# Altium schematic sheet LED_Circuit.SchDoc
size A; SheetNumber: 1; SheetTotal: 1; SPICEModelCacheNXRCWZZP: <root> / <DocumentId>NXRCWZZP</DocumentId> / </root>
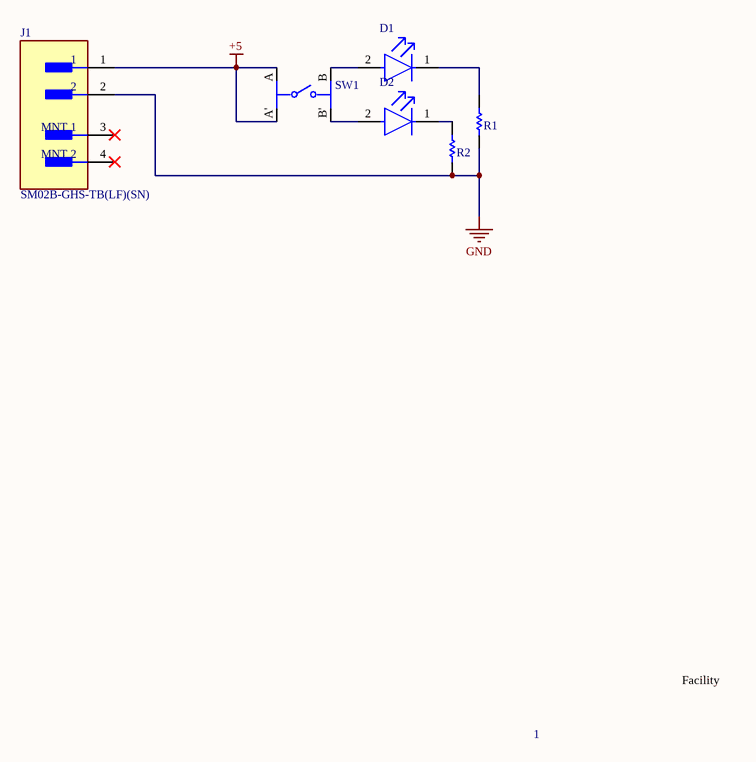
[diagram p0: LED_Circuit.SchDoc]

## Parts
D1  HSMG-C150  [FP-HSMG-C150-MFG]  (value not drawn)
D2  HSMG-C150  [FP-HSMG-C150-MFG]  (value not drawn)
J1  SM02B-GHS-TB(LF)(SN)  [FP-SM02B-GHS-TB_LF_SN-MFG]
R1  ERJ8CWFR018V  [RESC3216X70X50NL05T20]  (value not drawn)
R2  ERJ8CWFR018V  [RESC3216X70X50NL05T20]  (value not drawn)
SW1  EVQ-Q2P03W  [FP-EVQ-Q2P03W-MFG]  (value not drawn)

## Nets
+5: J1.1 SW1.A SW1.A'
GND: J1.2 R1.1 R2.1
NetD1_1: D1.1(C) R1.2
NetD1_2: D1.2(A) SW1.B
NetD2_1: D2.1(C) R2.2
NetD2_2: D2.2(A) SW1.B'

Not connected (* = marked no-connect by the designer): J1 3(MNT_1)* 4(MNT_2)*

## Notes on the sheet
- Facility
- 1

## Library data of the parts
D1 D2 = CMP-2000-05061-2: LED GREEN DIFFUSED 1206 SMD; Manufacturer: Broadcom; Led Orientation: Top View; Max Junction Temp: +95°C; Peak Emmision Wavelength: 570nm; Viewing Angle: 170°; Wavelength: 572nm; Reverse Voltage: 5V; Luminous Intensity: 15mcd; Description: Surface Mount Chip LEDs; Forward Voltage: 2.2V; Power Dissipation: 65mW; Forward Current: 20mA; ComponentLink2Description: Datasheet; Lead Free: Yes; Temperature Range Low: -40°C; Package: HSMG-C150; Digikey Description: LED GREEN DIFFUSED 1206 SMD; Mouser Description: LED Uni-Color Green 570nm 2-Pin Chip LED T/R; Manufacturer Part Number: HSMG-C150; Temperature Range High: +85°C; Device Class L1: Optoelectronics; Colour: Green; Category: Diode; Device Class L3: unset; RoHS: TRUE; Height: 1.2mm; ComponentLink2URL: https://docs.broadcom.com/docs/AV02-0551EN; Device Class L2: LEDs; Automotive: No; Ipc Land Pattern Name: DIOCP320160X55; Octopart: https://octopart.com/hsmg-c150-broadcom-71131304; Temperature: -40°C to +85°C
J1 = CMP-2000-07076-2: CONN HEADER SMD R/A 2POS 1.25MM; Voltage Rating: 50V; Number of Positions: 2; Pitch: 0.049inch; Current Rating: 1A; Connector Type: Outer Shroud Contact; Number of Rows: 1; Contact Material: Bronze; Termination: Solder; Color: Natural; Package Quantity: 2500; Mount: Surface Mount; Housing Color: Natural; Number of Contacts: 2; Packaging: Tape and Reel; Lead Free: Lead Free; Housing Material: Nylon; Orientation: Right Angle; Contact Type: Male Pin; Contact Plating: Tin; Series: GH; Fastening Type: Latch
R1 R2 = CMP-2003-00792-1: Manufacturer: Panasonic; value: 220; Part Number: ERJ8CWFR018V
SW1 = CMP-05618-000082-1: SWITCH TACTILE SPST-NO 0.02A 15V; Voltage Rating (AC): 250V; Operating Force: 1.6N; Actuator Length: 1.3mm; Actuator Type: Standard; Contact Current Rating: 20mA; Illumination Type: Non-Illuminated; Contact Resistance: 100mR; Actuator Color: White; Electrical Life: 1000000Cycles; Body Depth: 6mm; Switch Function: Off-Mom; Switch Travel: 0.25mm; Throw Configuration: SPST; Number of Poles: 1; Mount: Surface Mount; Case/Package: SMD/SMT; Packaging: Tape and Reel; Package Quantity: 1; Depth: 6.6mm; Max Operating Temperature: 85°C; Thickness: 1.8mm; Size: 1.8mm; Series: EVQQ2; Width: 6.5mm; Voltage Rating (DC): 15V; Termination: SMD/SMT; Length: 6mm; Lead Free: Lead Free; Orientation: Straight; Current Rating: 20mA; Max Current Rating: 20mA; Height: 3.1mm; Radiation Hardening: No; Mechanical Life: 1000000Cycles; Min Operating Temperature: -40°C; Max Voltage Rating (DC): 15V; Color: White